# Altium schematic sheet Overview.SchDoc: DAC Breakout
size A4; SheetNumber: 1; SheetTotal: 4
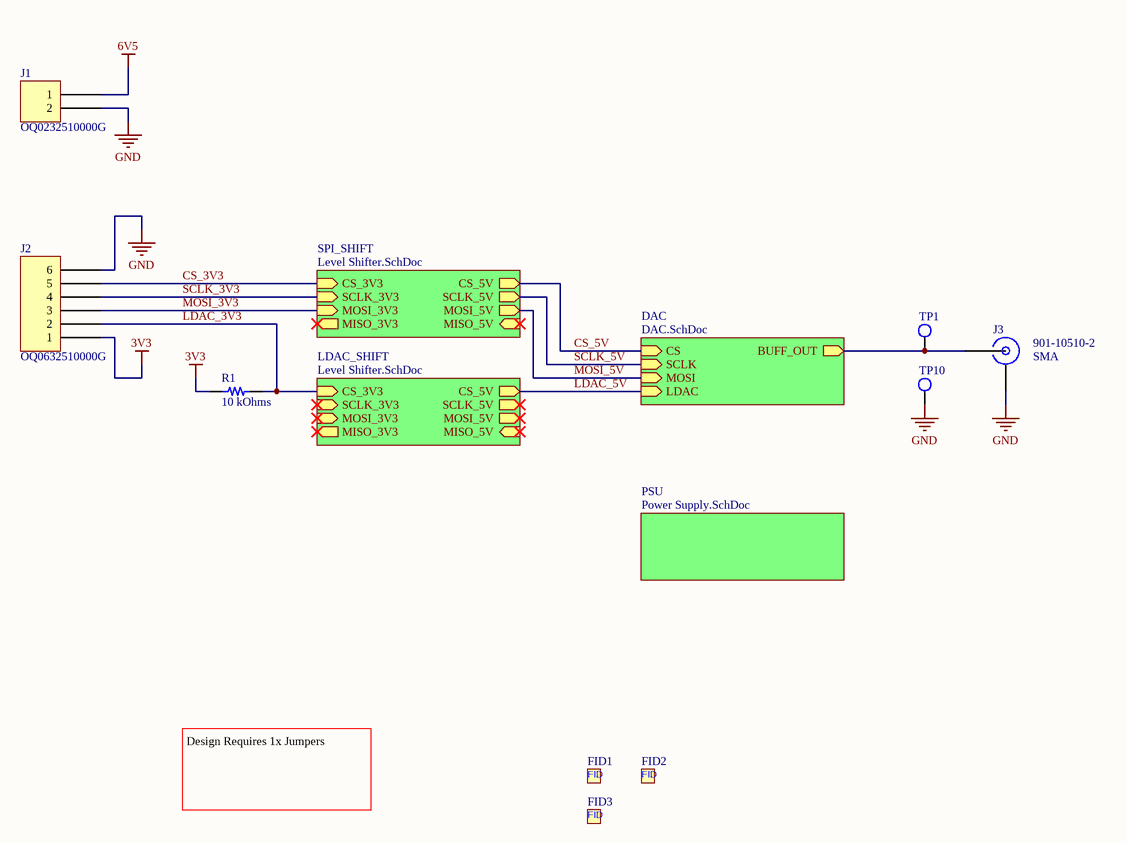
[diagram p0: Overview.SchDoc]

## Parts
FID1  Fiducial  [Fiducial-1mm]  (value not drawn)  (no BOM)
FID2  Fiducial  [Fiducial-1mm]  (value not drawn)  (no BOM)
FID3  Fiducial  [Fiducial-1mm]  (value not drawn)  (no BOM)
J1  OQ0232510000G  [FCI 06-381-2PIN]
J2  OQ0632510000G  [FCI 06-381-6PIN]
J3  901-10510-2  Connector Style: SMA  [AMPHENOL 901-10510-2]
R1  10 kOhms  [RES 0603_1608]
TP1  Test Point  [TestPoint-1.5mm]  (value not drawn)  (no BOM)
TP10  Test Point  [TestPoint-1.5mm]  (value not drawn)  (no BOM)

## Sub-sheets
DAC = DAC.SchDoc: CS (in), SCLK (in), MOSI (in), LDAC (in), BUFF_OUT (out)
LDAC_SHIFT = Level Shifter.SchDoc: CS_3V3 (in), SCLK_3V3 (in), MOSI_3V3 (in), MISO_3V3 (out), CS_5V (out), SCLK_5V (out), MOSI_5V (out), MISO_5V (in)
PSU = Power Supply.SchDoc: no entries
SPI_SHIFT = Level Shifter.SchDoc: CS_3V3 (in), SCLK_3V3 (in), MOSI_3V3 (in), MISO_3V3 (out), CS_5V (out), SCLK_5V (out), MOSI_5V (out), MISO_5V (in)

## Nets
3V3: J2.1 R1.2
6V5: J1.1
GND: J1.2 J2.6 J3.G(GND) TP10.1(TP)
CS_3V3: J2.5 ; sheet SPI_SHIFT/CS_3V3
CS_5V: sheet DAC/CS, sheet SPI_SHIFT/CS_5V
LDAC_3V3: J2.2 R1.1 ; sheet LDAC_SHIFT/CS_3V3
LDAC_5V: sheet DAC/LDAC, sheet LDAC_SHIFT/CS_5V
MOSI_3V3: J2.3 ; sheet SPI_SHIFT/MOSI_3V3
MOSI_5V: sheet DAC/MOSI, sheet SPI_SHIFT/MOSI_5V
SCLK_3V3: J2.4 ; sheet SPI_SHIFT/SCLK_3V3
SCLK_5V: sheet DAC/SCLK, sheet SPI_SHIFT/SCLK_5V
NetJ3_S: J3.S(SIGNAL) TP1.1(TP) ; sheet DAC/BUFF_OUT

## Notes on the sheet
- Design Requires 1x Jumpers
- Title
- Size:
- Date:
- A4
- Number:
- Time:
- Revision:
- Sheet
- of
- File:
- (in symbol CMP-002-000000-1) FID

## Library data of the parts
FID1-FID3 = CMP-002-000000-1: Design Item ID: Fiducial; Component Type: Standard; Source: Fiducial.SchLib; Pin Count: 0
J1 = OQ0232510000G: TERM BLOCK HDR 2POS 90DEG 3.81MM; Manufacturer: Amphenol Anytek; Current - UL: 10A; Header Orientation: 90°, Right Angle; Number of Levels: 1; Number of Positions: 2; Pitch: 0.150" (3.81mm); Voltage - UL: 300V; Part Number: OQ0232510000G; Color: Green; ComponentLink1Description: Datasheet; ComponentLink1URL: http://portal.fciconnect.com/Comergent//fci/drawing/oqxx32x100j0g.pdf; ComponentLink2Description: DigiKey Link; ComponentLink2URL: //digikey.com/product-detail/en/amphenol-anytek/OQ0232510000G/609-3819-ND/2261255; Contact Mating Finish: Tin; LastUpdated: 16/12/2019 19:14:30; Lifecycle Status: 0; Minimum Order: 1; Mounting Type: Through Hole; Operating Temperature: -40°C ~ 115°C; Packaging: Bulk; Part Status: Active; Positions Per Level: 2; Price: 0.49; Series: 06-381; Supplier 1: DigiKey; Supplier Part Number 1: 609-3819-ND; Termination Style: Solder; Type: Header, Male Pins, Shrouded (4 Side)
J2 = OQ0632510000G: TERM BLOCK HDR 6POS 90DEG 3.81MM; Manufacturer: Amphenol Anytek; Current - UL: 10A; Header Orientation: 90°, Right Angle; Number of Levels: 1; Number of Positions: 6; Pitch: 0.150" (3.81mm); Voltage - UL: 300V; Part Number: OQ0632510000G; Color: Green; ComponentLink1Description: Datasheet; ComponentLink1URL: http://portal.fciconnect.com/Comergent//fci/drawing/oqxx32x100j0g.pdf; ComponentLink2Description: DigiKey Link; ComponentLink2URL: //digikey.com/product-detail/en/amphenol-anytek/OQ0632510000G/609-3823-ND/2261282; Contact Mating Finish: Tin; LastUpdated: 16/12/2019 19:16:11; Lifecycle Status: 0; Minimum Order: 1; Mounting Type: Through Hole; Operating Temperature: -40°C ~ 115°C; Packaging: Bulk; Part Status: Active; Positions Per Level: 6; Price: 0.80; Series: 06-381; Supplier 1: DigiKey; Supplier Part Number 1: 609-3823-ND; Termination Style: Solder; Type: Header, Male Pins, Shrouded (4 Side)
J3 = 901-10510-2: CONN SMA JACK R/A 50OHM EDGE MNT; Manufacturer: Amphenol RF; Connector Type: Jack, Female Socket; Contact Termination: Solder; Frequency - Max: 26.5 GHz; Number of Ports: 1; Part Number: 901-10510-2; ComponentLink1Description: Datasheet; ComponentLink1URL: http://www.amphenolrf.com/index.php/downloads/dl/file/id/7684/product/0/sma_high_frequency_connectors.pdf; ComponentLink2Description: DigiKey Link; ComponentLink2URL: https://www.digikey.com/en/products/detail/amphenol-rf/901-10510-2/6051059; Fastening Type: Threaded; Impedance: 50Ohm; LastUpdated: 29/03/2023 22:34:51; Lifecycle Status: Active; Minimum Order: 1; Mounting Type: Board Edge, End Launch; Through Hole, Right Angle; Packaging: Bulk; Part Status: Active; Price: 7.52; Series: -; Shield Termination: Solder; Supplier 1: DigiKey; Supplier Part Number 1: ARF2496-ND
R1 = CR0603-FX-1002ELF: RES SMD 10K OHM 1% 1/10W 0603; Manufacturer: Bourns Inc.; Power (Watts): 0.1W, 1/10W; Temperature Coefficient: ±100ppm/°C; Part Number: CR0603-FX-1002ELF; Value: 10 kOhms; ComponentLink1Description: Datasheet; ComponentLink1URL: https://www.bourns.com/docs/Product-Datasheets/CHPREZTR.pdf; ComponentLink2Description: DigiKey Link; ComponentLink2URL: https://www.digikey.com/en/products/detail/bourns-inc/CR0603-FX-1002ELF/3593188; Composition: Thick Film; Device Package: 0603 (1608 Metric); Features: Moisture Resistant; Height - Seated (Max): 0.022" (0.55mm); LastUpdated: 20/01/2024 20:40:24; Lifecycle Status: Active; Minimum Order: 1; Number of Terminations: 2; Operating Temperature: -55°C ~ 155°C; Package / Case: 0603 (1608 Metric); Packaging: CutTape; PartId: 17321; Part Status: Active; Price: 0.01; Resistance: 10 kOhms; Series: CR0603; Size / Dimension: 0.063" L x 0.031" W (1.60mm x 0.80mm); Supplier 1: DigiKey; Supplier Part Number 1: CR0603-FX-1002ELFCT-ND; Supplier Device Package: 0603; Tolerance: ±1%
TP1 TP10 = CMP-003-000000-1: Component Type: Standard (No BOM); Source: Test Point.SchLib; Design Item ID: Test Point; Pin Count: 1